# Altium project braking_io.PrjPcb (part 3 of 3)

## Sheet solenoid_drv.SchDoc: Solenoid Control
size A4; Organization: Badgerloop Electrical; Address1: 133 Engineering Research Building; Address2: 1500 Engineering Drive; Address3: Madison, Wi 53706
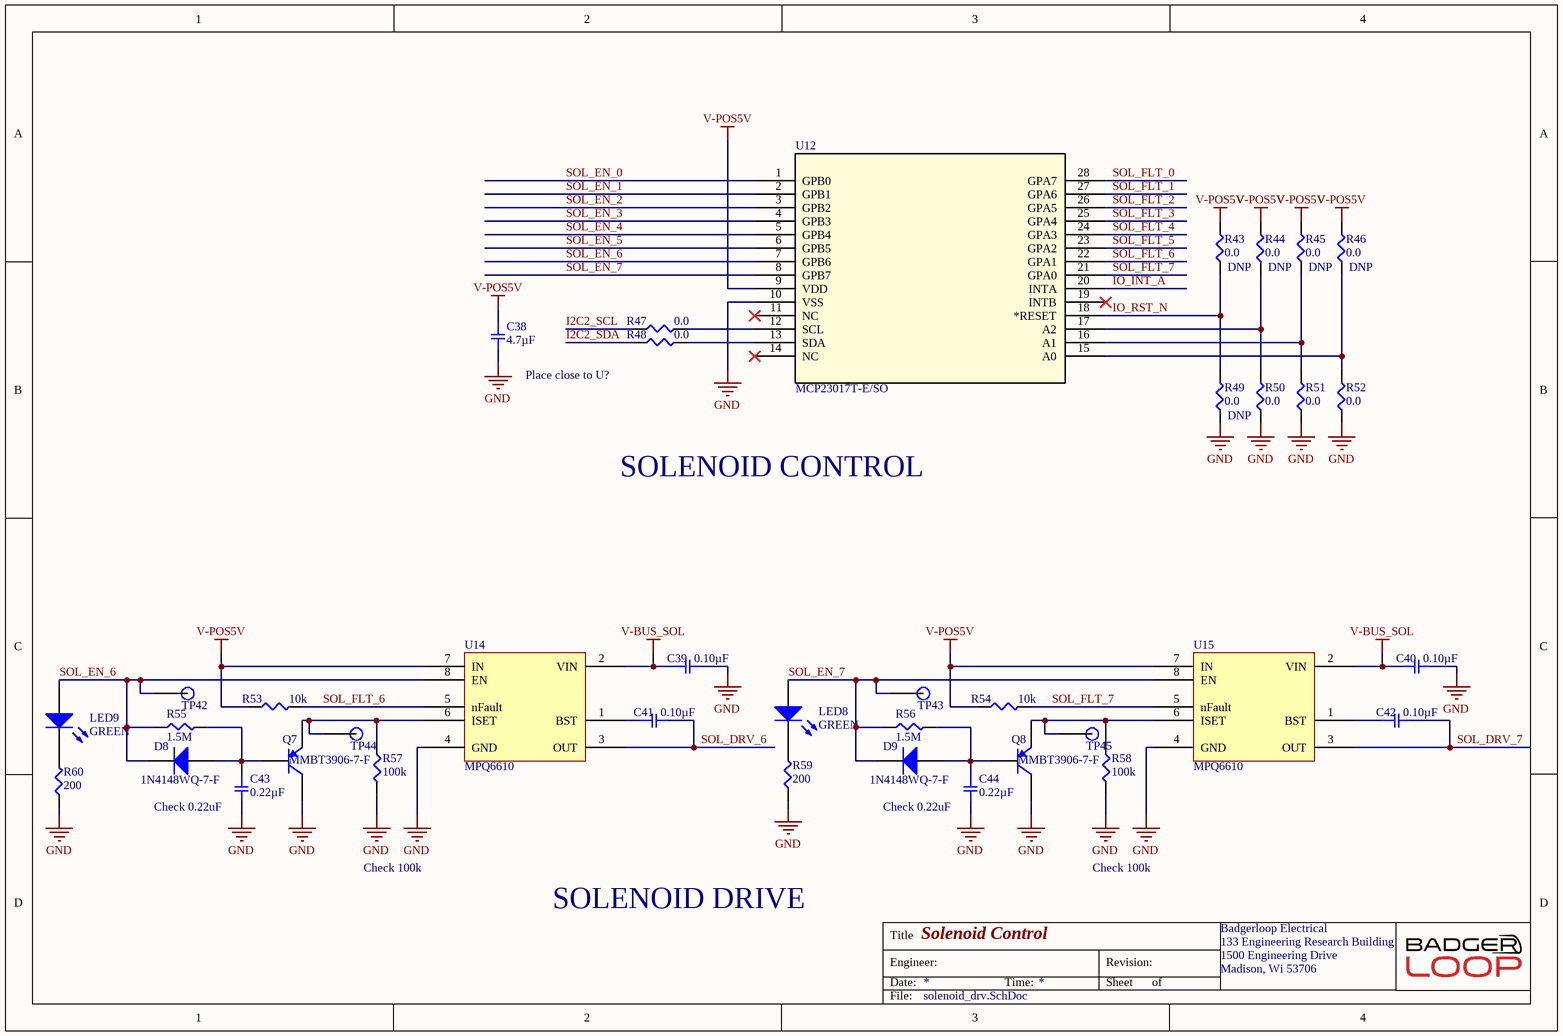
[diagram p6: solenoid_drv.SchDoc]

### Parts
C38  4.7µF  [SMD-0805C]
C39  0.10µF  [SMD-0805C]
C40  0.10µF  [SMD-0805C]
C41  0.10µF  [SMD-0805C]
C42  0.10µF  [SMD-0805C]
C43  0.22µF  [SMD-0805C]
C44  0.22µF  [SMD-0805C]
D8  1N4148WQ-7-F  [SODFL350X80-2N]
D9  1N4148WQ-7-F  [SODFL350X80-2N]
LED8  GREEN  [LED 0603 GREEN]
LED9  GREEN  [LED 0603 GREEN]
Q7  MMBT3906-7-F  [SOTFL103P240X110-3N]
Q8  MMBT3906-7-F  [SOTFL103P240X110-3N]
R43  0.0  [SMD-0805-RES]
R44  0.0  [SMD-0805-RES]
R45  0.0  [SMD-0805-RES]
R46  0.0  [SMD-0805-RES]
R47  0.0  [SMD-0805-RES]
R48  0.0  [SMD-0805-RES]
R49  0.0  [SMD-0805-RES]
R50  0.0  [SMD-0805-RES]
R51  0.0  [SMD-0805-RES]
R52  0.0  [SMD-0805-RES]
R53  10k  [SMD-0805-RES]
R54  10k  [SMD-0805-RES]
R55  1.5M  [SMD-0805-RES]
R56  1.5M  [SMD-0805-RES]
R57  100k  [SMD-0805-RES]
R58  100k  [SMD-0805-RES]
R59  200  [SMD-0805-RES]
R60  200  [SMD-0805-RES]
TP42  TP  [Test Point]  (value not drawn)
TP43  TP  [Test Point]  (value not drawn)
TP44  TP  [Test Point]  (value not drawn)
TP45  TP  [Test Point]  (value not drawn)
U12  MCP23017T-E/SO  [SOIC28-W_MC-M]
U14  MPQ6610  [SOP127P600X175-8N]
U15  MPQ6610  [SOP127P600X175-8N]

### Nets
GND: C38.2 C39.2 C40.2 C43.2 C44.2 Q7.3(C) Q8.3(C) R49.1 R50.1 R51.1 R52.1 R57.2 R58.2 R59.1 R60.1 U12.10(VSS) U14.4(GND) U15.4(GND)
V-BUS_SOL: C39.1 C40.1 U14.2(VIN) U15.2(VIN)
V-POS5V: C38.1 R43.2 R44.2 R45.2 R46.2 R53.1 R54.1 U12.9(VDD) U14.7(IN) U15.7(IN)
I2C2_SCL: R47.1
I2C2_SDA: R48.1
IO_INT_A: U12.20(INTA)
IO_RST_N: R43.1 R49.2 U12.18(*RESET)
SOL_DRV_6: C41.2 U14.3(OUT)
SOL_DRV_7: C42.2 U15.3(OUT)
SOL_EN_0: U12.1(GPB0)
SOL_EN_1: U12.2(GPB1)
SOL_EN_2: U12.3(GPB2)
SOL_EN_3: U12.4(GPB3)
SOL_EN_4: U12.5(GPB4)
SOL_EN_5: U12.6(GPB5)
SOL_EN_6: D8.2(K) LED9.1(A) R55.1 TP42.1 U12.7(GPB6) U14.8(EN)
SOL_EN_7: D9.2(K) LED8.1(A) R56.1 TP43.1 U12.8(GPB7) U15.8(EN)
SOL_FLT_0: U12.28(GPA7)
SOL_FLT_1: U12.27(GPA6)
SOL_FLT_2: U12.26(GPA5)
SOL_FLT_3: U12.25(GPA4)
SOL_FLT_4: U12.24(GPA3)
SOL_FLT_5: U12.23(GPA2)
SOL_FLT_6: R53.2 U12.22(GPA1) U14.5(nFault)
SOL_FLT_7: R54.2 U12.21(GPA0) U15.5(nFault)
NetC41_1: C41.1 U14.1(BST)
NetC42_1: C42.1 U15.1(BST)
NetC43_1: C43.1 D8.1(A) Q7.1(B) R55.2
NetC44_1: C44.1 D9.1(A) Q8.1(B) R56.2
NetLED8_2: LED8.2(K) R59.2
NetLED9_2: LED9.2(K) R60.2
NetQ7_2: Q7.2(E) R57.1 TP44.1 U14.6(ISET)
NetQ8_2: Q8.2(E) R58.1 TP45.1 U15.6(ISET)
NetR44_1: R44.1 R50.2 U12.17(A2)
NetR45_1: R45.1 R51.2 U12.16(A1)
NetR46_1: R46.1 R52.2 U12.15(A0)
NetR47_2: R47.2 U12.12(SCL)
NetR48_2: R48.2 U12.13(SDA)

Not connected (* = marked no-connect by the designer): U12 11(NC)* 14(NC)* 19(INTB)*

### Notes on the sheet
- Place close to U?
- SOLENOID CONTROL
- (near C43) Check 0.22uF
- (near C44) Check 0.22uF
- Check 100k
- SOLENOID DRIVE
- Title
- Engineer:
- Date:
- Time:
- Revision:
- Sheet
- of
- File:

### Library data of the parts
C38 = GRM21BR60J475KA11L: CAP CER 4.7UF 6.3V X5R 0805; Manufacturer: Murata Electronics North America; Factory Stock: 0; Unit Price (USD): 0.28; Minimum Quantity: 1; Tolerance: ±10%; Datasheets: http://www.murata.com/~/media/webrenewal/support/library/catalog/products/capacitor/mlcc/c02e.pdf; Image: //media.digikey.com/Renders/Murata%20Renders/0805%20(2012%20Metric)%20.85mm.jpg; Digi-Key Part Number: 490-9749-1-ND; Part Number: GRM21BR60J475KA11L; Quantity Available: 2821; @ qty: 0; Packaging: Cut Tape (CT); Series: GRM; Part Status: Active; Value: 4.7µF; Voltage: 6.3V; Temperature Coefficient: X5R; Operating Temperature: -55°C ~ 85°C; Features: -; Ratings: -; Applications: General Purpose; Mounting Type: Surface Mount, MLCC; Package / Case: 0805 (2012 Metric); Size / Dimension: 0.079" L x 0.049" W (2.00mm x 1.25mm); Height - Seated (Max): -; Thickness (Max): 0.055" (1.40mm); Lead Spacing: -; Lead Style: -
C39-C42 = GRM21B7U1A104JA01L: CAP CER 0.1UF 10V U2J 0805; Manufacturer: Murata Electronics North America; Factory Stock: 0; Unit Price (USD): 0.4; Minimum Quantity: 1; Tolerance: ±5%; Datasheets: http://www.murata.com/~/media/webrenewal/support/library/catalog/products/capacitor/mlcc/c02e.pdf; Image: //media.digikey.com/Renders/Murata%20Renders/0805%20(2012%20Metric)%20.85mm.jpg; Digi-Key Part Number: 490-11592-1-ND; Part Number: GRM21B7U1A104JA01L; Quantity Available: 3390; @ qty: 0; Packaging: Cut Tape (CT); Series: GRM; Part Status: Active; Value: 0.10µF; Voltage: 10V; Temperature Coefficient: U2J; Operating Temperature: -55°C ~ 125°C; Features: -; Ratings: -; Applications: General Purpose; Mounting Type: Surface Mount, MLCC; Package / Case: 0805 (2012 Metric); Size / Dimension: 0.079" L x 0.049" W (2.00mm x 1.25mm); Height - Seated (Max): -; Thickness (Max): 0.053" (1.35mm); Lead Spacing: -; Lead Style: -
C43 C44 = LLA215R71A224MA14L: CAP CER 0.22UF 10V X7R 0805; Manufacturer: Murata Electronics North America; Factory Stock: 0; Unit Price (USD): 0.36; Minimum Quantity: 1; Tolerance: ±20%; Datasheets: http://www.murata.com/~/media/webrenewal/support/library/catalog/products/capacitor/mlcc/c02e.pdf; Image: //media.digikey.com/Renders/Murata%20Renders/0805-LLA.jpg; Digi-Key Part Number: 490-4432-1-ND; Part Number: LLA215R71A224MA14L; Quantity Available: 9914; @ qty: 0; Packaging: Cut Tape (CT); Series: LLA; Part Status: Active; Value: 0.22µF; Voltage: 10V; Temperature Coefficient: X7R; Operating Temperature: -55°C ~ 125°C; Features: Low ESL (Multi-Terminal); Ratings: -; Applications: Bypass, Decoupling; Mounting Type: Surface Mount, MLCC; Package / Case: 0805 (2012 Metric); Size / Dimension: 0.079" L x 0.049" W (2.00mm x 1.25mm); Height - Seated (Max): -; Thickness (Max): 0.022" (0.55mm); Lead Spacing: -; Lead Style: -
D8 D9 = 1N4148WQ-7-F: Diodes - General Purpose, Power, Switching SMT Fast Switching Diode; Manufacturer: Diodes Inc.; Digikey Link: https://www.digikey.com/product-detail/en/diodes-incorporated/1N4148WQ-7-F/1N4148WQ-7-FDITR-ND/8136126; Manufacturer P/N: 1N4148WQ-7-F; Digikey P/N: 1N4148WQ-7-FDITR-ND
LED8 LED9 = LED GREEN 0603: Manufacturer: Lite-On Inc.; Manufacturer P/N: LTST-C190KGKT; Digikey P/N: 160-1435-1-ND; Package / Case: 0603; Color: GREEN
Q7 Q8 = MMBT3906-7-F: Manufacturer: Diodes Zetex; Collector Emitter Voltage (VCEO): 40V; Max Power Dissipation: 300mW; Polarity: PNP; Max Collector Current: 200mA; hFE Min: 100; Number of Elements: 1; Frequency: 250MHz; Emitter Base Voltage (VEBO): 6V; Collector Emitter Saturation Voltage: -400mV; Element Configuration: Single; Continuous Collector Current: -200mA; Voltage Rating (DC): -40V; Supplier 1: Digi-Key; Manufacturer Part Number: MMBT3906-7-F; Stock 1: 687580; Pricing 1: 1=0.12000, 10=0.11400, 100=0.06190, 500=0.03806, 1000=0.02596 (USD); RoHS: Yes; Mount: Surface Mount; Case/Package: SOT-23; Number of Pins: 3; Weight: 0.000282oz; Contact Plating: Tin,Matte; Min Operating Temperature: -55°C; Max Operating Temperature: 150°C; Packaging: Tape and Reel; Package Quantity: 3000; Transition Frequency: 250MHz; Collector Emitter Breakdown Voltage: 40V; Max Breakdown Voltage: 40V; Collector Base Voltage (VCBO): 40V; Power Dissipation: 300mW; Max Frequency: 250MHz; Gain Bandwidth Product: 250MHz; Current Rating: -200mA; Length: 3.05mm; Height: 1mm; Width: 1.4mm; Radiation Hardening: No; REACH SVHC: No SVHC; Lead Free: Lead Free; ComponentLink1URL: https://datasheet.ciiva.com/27052/1540746-27052408.pdf?src-supplier=Jameco; ComponentLink1Description: https://datasheet.ciiva.com/27052/1540746-27052408.pdf?src-supplier=Jameco; ComponentLink2URL: https://datasheet.ciiva.com/15139/getdatasheetpartid-255292-15139821.pdf?src-supplier=Verical; ComponentLink2Description: https://datasheet.ciiva.com/15139/getdatasheetpartid-255292-15139821.pdf?src-supplier=Verical
R43-R52 = ERJ-6GEY0R00V: RES SMD 0.0 OHM JUMPER 1/8W 0805; Manufacturer: Panasonic Electronic Components; Factory Stock: 0; Unit Price (USD): 0.00544; @ qty: 1500; Minimum Quantity: 1; Power (Watts): 0.125W, 1/8W; Part Number: ERJ-6GEY0R00V; Datasheets: http://industrial.panasonic.com/www-cgi/jvcr13pz.cgi?E+PZ+3+AOA0001+ERJ6GEY0R00V+7+WW; Image: //media.digikey.com/Renders/Panasonic%20Renders/ERJ-0805%20Pkg.jpg; Digi-Key Part Number: P0.0ACT-ND; Quantity Available: 1597627; Packaging: Cut Tape (CT); Series: ERJ; Part Status: Active; Value: 0.0; Tolerance: Jumper; Composition: Thick Film; Features: Automotive AEC-Q200; Temperature Coefficient: -; Operating Temperature: -55°C ~ 155°C; Package / Case: 0805 (2012 Metric); Supplier Device Package: 0805; Size / Dimension: 0.079" L x 0.049" W (2.00mm x 1.25mm); Height - Seated (Max): 0.028" (0.70mm); Number of Terminations: 2; Failure Rate: -
  R43-R46 R49: DNP: DNP
R53 R54 = ERJ-P06J103V: RES SMD 10K OHM 5% 1/2W 0805; Manufacturer: Panasonic Electronic Components; Factory Stock: 0; Unit Price (USD): 0.01839; @ qty: 1500; Minimum Quantity: 1; Power (Watts): 0.5W, 1/2W; Temperature Coefficient: ±200ppm/°C; Part Number: ERJ-P06J103V; Datasheets: https://industrial.panasonic.com/cdbs/www-data/pdf/RDA0000/AOA0000C243.pdf; Image: //media.digikey.com/Renders/Panasonic%20Renders/ERJ-0805%20Pkg.jpg; Digi-Key Part Number: P10KADCT-ND; Quantity Available: 413576; Packaging: Cut Tape (CT); Series: ERJ; Part Status: Active; Value: 10k; Tolerance: ±5%; Composition: Thick Film; Features: Automotive AEC-Q200, Pulse Withstanding; Operating Temperature: -55°C ~ 155°C; Package / Case: 0805 (2012 Metric); Supplier Device Package: 0805; Size / Dimension: 0.079" L x 0.049" W (2.00mm x 1.25mm); Height - Seated (Max): 0.028" (0.70mm); Number of Terminations: 2; Failure Rate: -
R55 R56 = ERJ-6GEYJ155V: RES SMD 1.5M OHM 5% 1/8W 0805; Manufacturer: Panasonic Electronic Components; Factory Stock: 0; Unit Price (USD): 0.00496; @ qty: 1500; Minimum Quantity: 1; Power (Watts): 0.125W, 1/8W; Temperature Coefficient: -400/ +150ppm/°C; Part Number: ERJ-6GEYJ155V; Datasheets: http://industrial.panasonic.com/www-cgi/jvcr13pz.cgi?E+PZ+3+AOA0001+ERJ6GEYJ155V+7+WW; Image: //media.digikey.com/Renders/Panasonic%20Renders/ERJ-0805%20Pkg.jpg; Digi-Key Part Number: P1.5MACT-ND; Quantity Available: 51728; Packaging: Cut Tape (CT); Series: ERJ; Part Status: Active; Value: 1.5M; Tolerance: ±5%; Composition: Thick Film; Features: Automotive AEC-Q200; Operating Temperature: -55°C ~ 155°C; Package / Case: 0805 (2012 Metric); Supplier Device Package: 0805; Size / Dimension: 0.079" L x 0.049" W (2.00mm x 1.25mm); Height - Seated (Max): 0.028" (0.70mm); Number of Terminations: 2; Failure Rate: -
R57 R58 = ERJ-P06J104V: RES SMD 100K OHM 5% 1/2W 0805; Manufacturer: Panasonic Electronic Components; Factory Stock: 0; Unit Price (USD): 0.01839; @ qty: 1500; Minimum Quantity: 1; Power (Watts): 0.5W, 1/2W; Temperature Coefficient: ±200ppm/°C; Part Number: ERJ-P06J104V; Datasheets: https://industrial.panasonic.com/cdbs/www-data/pdf/RDA0000/AOA0000C243.pdf; Image: //media.digikey.com/Renders/Panasonic%20Renders/ERJ-0805%20Pkg.jpg; Digi-Key Part Number: P100KADCT-ND; Quantity Available: 82264; Packaging: Cut Tape (CT); Series: ERJ; Part Status: Active; Value: 100k; Tolerance: ±5%; Composition: Thick Film; Features: Automotive AEC-Q200, Pulse Withstanding; Operating Temperature: -55°C ~ 155°C; Package / Case: 0805 (2012 Metric); Supplier Device Package: 0805; Size / Dimension: 0.079" L x 0.049" W (2.00mm x 1.25mm); Height - Seated (Max): 0.028" (0.70mm); Number of Terminations: 2; Failure Rate: -
R59 R60 = ERJ-P06F2000V: RES SMD 200 OHM 1% 1/2W 0805; Manufacturer: Panasonic Electronic Components; Factory Stock: 0; Unit Price (USD): 0.02534; @ qty: 1500; Minimum Quantity: 1; Power (Watts): 0.5W, 1/2W; Temperature Coefficient: ±100ppm/°C; Part Number: ERJ-P06F2000V; Datasheets: https://industrial.panasonic.com/cdbs/www-data/pdf/RDA0000/AOA0000C243.pdf; Image: //media.digikey.com/Renders/Panasonic%20Renders/ERJ-0805%20Pkg.jpg; Digi-Key Part Number: P16064CT-ND; Quantity Available: 14258; Packaging: Cut Tape (CT); Series: ERJ; Part Status: Active; Value: 200; Tolerance: ±1%; Composition: Thick Film; Features: Automotive AEC-Q200, Pulse Withstanding; Operating Temperature: -55°C ~ 155°C; Package / Case: 0805 (2012 Metric); Supplier Device Package: 0805; Size / Dimension: 0.079" L x 0.049" W (2.00mm x 1.25mm); Height - Seated (Max): 0.028" (0.70mm); Number of Terminations: 2; Failure Rate: -
TP42-TP45 = TP: SMD TEST POINT
U12 = MCP23017T-E/SO: IC I/O EXPANDER I2C 16B 28SOIC; Manufacturer: Microchip; Manufacturer P/N: MCP23017T-E/SO; Digikey P/N: MCP23017T-E/SOCT-ND; Digikey Link: https://www.digikey.com/product-detail/en/microchip-technology/MCP23017T-E-SO/MCP23017T-E-SOCT-ND/5358289

## Sheet pressure.SchDoc: Pressure Sensors
size A4; Organization: Badgerloop Electrical; Address1: 133 Engineering Research Building; Address2: 1500 Engineering Drive; Address3: Madison, Wi 53706
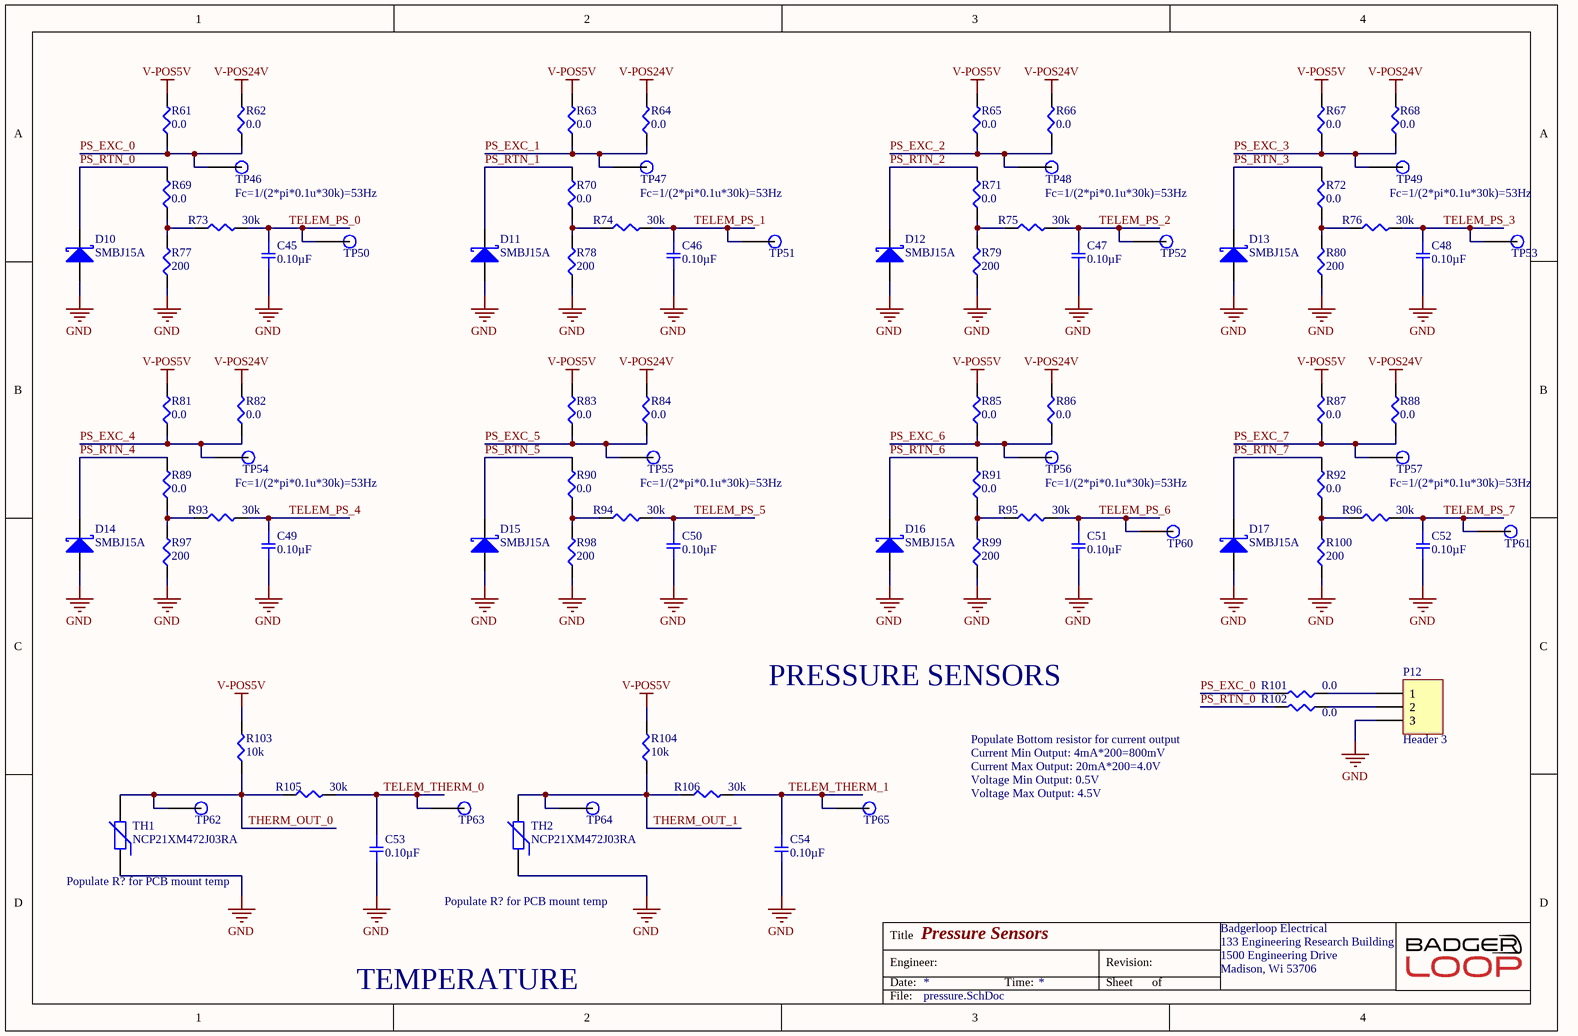
[diagram p7: pressure.SchDoc]

### Parts
C45  0.10µF  [SMD-0805C]
C46  0.10µF  [SMD-0805C]
C47  0.10µF  [SMD-0805C]
C48  0.10µF  [SMD-0805C]
C49  0.10µF  [SMD-0805C]
C50  0.10µF  [SMD-0805C]
C51  0.10µF  [SMD-0805C]
C52  0.10µF  [SMD-0805C]
C53  0.10µF  [SMD-0805C]
C54  0.10µF  [SMD-0805C]
D10  SMBJ15A  [DIOM4436X26N]
D11  SMBJ15A  [DIOM4436X26N]
D12  SMBJ15A  [DIOM4436X26N]
D13  SMBJ15A  [DIOM4436X26N]
D14  SMBJ15A  [DIOM4436X26N]
D15  SMBJ15A  [DIOM4436X26N]
D16  SMBJ15A  [DIOM4436X26N]
D17  SMBJ15A  [DIOM4436X26N]
P12  Header 3  [Pin Header 1x3 TH Pitch 2.54mm]
R61  0.0  [SMD-0805-RES]
R62  0.0  [SMD-0805-RES]
R63  0.0  [SMD-0805-RES]
R64  0.0  [SMD-0805-RES]
R65  0.0  [SMD-0805-RES]
R66  0.0  [SMD-0805-RES]
R67  0.0  [SMD-0805-RES]
R68  0.0  [SMD-0805-RES]
R69  0.0  [SMD-0805-RES]
R70  0.0  [SMD-0805-RES]
R71  0.0  [SMD-0805-RES]
R72  0.0  [SMD-0805-RES]
R73  30k  [SMD-0805-RES]
R74  30k  [SMD-0805-RES]
R75  30k  [SMD-0805-RES]
R76  30k  [SMD-0805-RES]
R77  200  [SMD-0805-RES]
R78  200  [SMD-0805-RES]
R79  200  [SMD-0805-RES]
R80  200  [SMD-0805-RES]
R81  0.0  [SMD-0805-RES]
R82  0.0  [SMD-0805-RES]
R83  0.0  [SMD-0805-RES]
R84  0.0  [SMD-0805-RES]
R85  0.0  [SMD-0805-RES]
R86  0.0  [SMD-0805-RES]
R87  0.0  [SMD-0805-RES]
R88  0.0  [SMD-0805-RES]
R89  0.0  [SMD-0805-RES]
R90  0.0  [SMD-0805-RES]
R91  0.0  [SMD-0805-RES]
R92  0.0  [SMD-0805-RES]
R93  30k  [SMD-0805-RES]
R94  30k  [SMD-0805-RES]
R95  30k  [SMD-0805-RES]
R96  30k  [SMD-0805-RES]
R97  200  [SMD-0805-RES]
R98  200  [SMD-0805-RES]
R99  200  [SMD-0805-RES]
R100  200  [SMD-0805-RES]
R101  0.0  [SMD-0805-RES]
R102  0.0  [SMD-0805-RES]
R103  10k  [SMD-0805-RES]
R104  10k  [SMD-0805-RES]
R105  30k  [SMD-0805-RES]
R106  30k  [SMD-0805-RES]
TH1  NCP21XM472J03RA  [SMD-0805-RES]
TH2  NCP21XM472J03RA  [SMD-0805-RES]
TP46  TP  [Test Point]  (value not drawn)
TP47  TP  [Test Point]  (value not drawn)
TP48  TP  [Test Point]  (value not drawn)
TP49  TP  [Test Point]  (value not drawn)
TP50  TP  [Test Point]  (value not drawn)
TP51  TP  [Test Point]  (value not drawn)
TP52  TP  [Test Point]  (value not drawn)
TP53  TP  [Test Point]  (value not drawn)
TP54  TP  [Test Point]  (value not drawn)
TP55  TP  [Test Point]  (value not drawn)
TP56  TP  [Test Point]  (value not drawn)
TP57  TP  [Test Point]  (value not drawn)
TP60  TP  [Test Point]  (value not drawn)
TP61  TP  [Test Point]  (value not drawn)
TP62  TP  [Test Point]  (value not drawn)
TP63  TP  [Test Point]  (value not drawn)
TP64  TP  [Test Point]  (value not drawn)
TP65  TP  [Test Point]  (value not drawn)

### Nets
GND: C45.2 C46.2 C47.2 C48.2 C49.2 C50.2 C51.2 C52.2 C53.2 C54.2 D10.2(K) D11.2(K) D12.2(K) D13.2(K) D14.2(K) D15.2(K) D16.2(K) D17.2(K) P12.3 R77.1 R78.1 R79.1 R80.1 R97.1 R98.1 R99.1 R100.1 TH1.1 TH2.1
V-POS5V: R61.2 R63.2 R65.2 R67.2 R81.2 R83.2 R85.2 R87.2 R103.2 R104.2
V-POS24V: R62.2 R64.2 R66.2 R68.2 R82.2 R84.2 R86.2 R88.2
PS_EXC_0: R61.1 R62.1 R101.2 TP46.1
PS_EXC_1: R63.1 R64.1 TP47.1
PS_EXC_2: R65.1 R66.1 TP48.1
PS_EXC_3: R67.1 R68.1 TP49.1
PS_EXC_4: R81.1 R82.1 TP54.1
PS_EXC_5: R83.1 R84.1 TP55.1
PS_EXC_6: R85.1 R86.1 TP56.1
PS_EXC_7: R87.1 R88.1 TP57.1
PS_RTN_0: D10.1(A) R69.2 R102.2
PS_RTN_1: D11.1(A) R70.2
PS_RTN_2: D12.1(A) R71.2
PS_RTN_3: D13.1(A) R72.2
PS_RTN_4: D14.1(A) R89.2
PS_RTN_5: D15.1(A) R90.2
PS_RTN_6: D16.1(A) R91.2
PS_RTN_7: D17.1(A) R92.2
TELEM_PS_0: C45.1 R73.2 TP50.1
TELEM_PS_1: C46.1 R74.2 TP51.1
TELEM_PS_2: C47.1 R75.2 TP52.1
TELEM_PS_3: C48.1 R76.2 TP53.1
TELEM_PS_4: C49.1 R93.2
TELEM_PS_5: C50.1 R94.2
TELEM_PS_6: C51.1 R95.2 TP60.1
TELEM_PS_7: C52.1 R96.2 TP61.1
TELEM_THERM_0: C53.1 R105.2 TP63.1
TELEM_THERM_1: C54.1 R106.2 TP65.1
THERM_OUT_0: R103.1 R105.1 TH1.2 TP62.1
THERM_OUT_1: R104.1 R106.1 TH2.2 TP64.1
NetP12_1: P12.1 R101.1
NetP12_2: P12.2 R102.1
NetR69_1: R69.1 R73.1 R77.2
NetR70_1: R70.1 R74.1 R78.2
NetR71_1: R71.1 R75.1 R79.2
NetR72_1: R72.1 R76.1 R80.2
NetR89_1: R89.1 R93.1 R97.2
NetR90_1: R90.1 R94.1 R98.2
NetR91_1: R91.1 R95.1 R99.2
NetR92_1: R92.1 R96.1 R100.2

### Notes on the sheet
- Fc=1/(2*pi*0.1u*30k)=53Hz
- PRESSURE SENSORS
- Populate Bottom resistor for current output
- Current Min Output: 4mA*200=800mV
- Current Max Output: 20mA*200=4.0V
- Voltage Min Output: 0.5V
- Voltage Max Output: 4.5V
- (near TH1) Populate R? for PCB mount temp
- (near TH2) Populate R? for PCB mount temp
- TEMPERATURE
- Title
- Engineer:
- Date:
- Time:
- Revision:
- Sheet
- of
- File:

### Library data of the parts
C45-C52 = GRM219R71E104KA01D: CAP CER 0.1UF 25V X7R 0805; Manufacturer: Murata Electronics North America; Factory Stock: 0; Unit Price (USD): 0.12; Minimum Quantity: 1; Tolerance: ±10%; Datasheets: http://www.murata.com/~/media/webrenewal/support/library/catalog/products/capacitor/mlcc/c02e.pdf; Image: //media.digikey.com/Renders/Murata%20Renders/0805%20(2012%20Metric)%20.85mm.jpg; Digi-Key Part Number: 490-12754-1-ND; Part Number: GRM219R71E104KA01D; Quantity Available: 8594; @ qty: 0; Packaging: Cut Tape (CT); Series: GRM; Part Status: Active; Value: 0.10µF; Voltage: 25V; Temperature Coefficient: X7R; Operating Temperature: -55°C ~ 125°C; Features: -; Ratings: -; Applications: General Purpose; Mounting Type: Surface Mount, MLCC; Package / Case: 0805 (2012 Metric); Size / Dimension: 0.079" L x 0.049" W (2.00mm x 1.25mm); Height - Seated (Max): -; Thickness (Max): 0.037" (0.95mm); Lead Spacing: -; Lead Style: -
C53 C54 = GRM219R71C104KA01D: CAP CER 0.1UF 16V X7R 0805; Manufacturer: Murata Electronics North America; Factory Stock: 0; Unit Price (USD): 0.13; Minimum Quantity: 1; Tolerance: ±10%; Datasheets: http://www.murata.com/~/media/webrenewal/support/library/catalog/products/capacitor/mlcc/c02e.pdf; Image: //media.digikey.com/Renders/Murata%20Renders/0805%20(2012%20Metric)%20.85mm.jpg; Digi-Key Part Number: 490-1683-1-ND; Part Number: GRM219R71C104KA01D; Quantity Available: 265464; @ qty: 0; Packaging: Cut Tape (CT); Series: GRM; Part Status: Active; Value: 0.10µF; Voltage: 16V; Temperature Coefficient: X7R; Operating Temperature: -55°C ~ 125°C; Features: -; Ratings: -; Applications: General Purpose; Mounting Type: Surface Mount, MLCC; Package / Case: 0805 (2012 Metric); Size / Dimension: 0.079" L x 0.049" W (2.00mm x 1.25mm); Height - Seated (Max): -; Thickness (Max): 0.037" (0.95mm); Lead Spacing: -; Lead Style: -
D10-D17 = SMBJ15A: TVS DIODE 15V 24.4V DO214AA; Manufacturer: Littelfuse; Direction: Unidirectional; Min Breakdown Voltage: 16.7V; Peak Pulse Power: 600W; Peak Pulse Current: 24.6A; Test Current: 1mA; Number of Elements: 1; Power Line Protection: No; Max Breakdown Voltage: 18.5V; Max Reverse Leakage Current: 1uA; Max Power Dissipation: 5W; Element Configuration: Single; ESD Protection: Yes; Current: 68A; Voltage: 5V; Supplier 1: Digi-Key; Manufacturer Part Number: SMBJ15A; Stock 1: 73945; Pricing 1: 1=0.45000, 10=0.33900, 25=0.30520, 100=0.21090, 250=0.17760, 500=0.14430, 1000=0.11100 (USD); RoHS: Yes; Mount: Surface Mount; Case/Package: SMB; Number of Pins: 2; Min Operating Temperature: -65°C; Max Operating Temperature: 150°C; Packaging: Tape and Reel; Reverse Standoff Voltage: 15V; Clamping Voltage: 24.4V; Power Dissipation: 600W; Voltage Rating (DC): 15V; Reverse Breakdown Voltage: 16.7V; Package Quantity: 3000; Operating Supply Voltage: 15V; Max Surge Current: 24.6A; Number of Unidirectional Channels: 1; Breakdown Voltage: 16.7V; Number of Channels: 1; Polarity: Unidirectional; Termination: SMD/SMT; Leakage Current: 1uA; Composition: Zener; Length: 4.57mm; Height: 2.237mm; Width: 3.94mm; Radiation Hardening: No; Lead Free: Lead Free; REACH SVHC: Unknown; ComponentLink1URL: https://datasheet.ciiva.com/34301/1078555-34301957.pdf?src-supplier=Jameco; ComponentLink1Description: https://datasheet.ciiva.com/34301/1078555-34301957.pdf?src-supplier=Jameco; ComponentLink2URL: https://datasheet.ciiva.com/25624/0900766b810f4eeb-25624826.pdf?src-supplier=RSComponents; ComponentLink2Description: https://datasheet.ciiva.com/25624/0900766b810f4eeb-25624826.pdf?src-supplier=RSComponents; ComponentLink3URL: https://datasheet.ciiva.com/46385/13057-46385079.pdf?src-supplier=Element14; ComponentLink3Description: https://datasheet.ciiva.com/46385/13057-46385079.pdf?src-supplier=Element14; ComponentLink4URL: https://datasheet.ciiva.com/331/littelfuse-tvs-diode-smbj-datasheet-pdf-331176.pdf?src-supplier=Digi-Key; ComponentLink4Description: https://datasheet.ciiva.com/331/littelfuse-tvs-diode-smbj-datasheet-pdf-331176.pdf?src-supplier=Digi-Key; ComponentLink5URL: https://datasheet.ciiva.com/331/littelfuse-tvs-diode-smbj-datasheet-pdf-331177.pdf?src-supplier=Digi-Key; ComponentLink5Description: https://datasheet.ciiva.com/331/littelfuse-tvs-diode-smbj-datasheet-pdf-331177.pdf?src-supplier=Digi-Key; ComponentLink6URL: https://datasheet.ciiva.com/331/littelfuse-tvs-diode-smbj-datasheet-pdf-331178.pdf?src-supplier=Digi-Key; ComponentLink6Description: https://datasheet.ciiva.com/331/littelfuse-tvs-diode-smbj-datasheet-pdf-331178.pdf?src-supplier=Digi-Key; Supplier 2: Digi-Key; Stock 2: 69911; Pricing 2: 1=0.35000, 10=0.28700, 25=0.26240, 100=0.19540, 250=0.17704, 500=0.14652, 1000=0.10989 (USD); ComponentLink7URL: https://datasheet.ciiva.com/25624/0900766b810f4eeb-25624712.pdf?src-supplier=RSComponents; ComponentLink7Description: https://datasheet.ciiva.com/25624/0900766b810f4eeb-25624712.pdf?src-supplier=RSComponents; ComponentLink8URL: https://datasheet.ciiva.com/34302/1546929-34302459.pdf?src-supplier=Jameco; ComponentLink8Description: https://datasheet.ciiva.com/34302/1546929-34302459.pdf?src-supplier=Jameco; ComponentLink9URL: https://datasheet.ciiva.com/46381/1677318-46381958.pdf?src-supplier=Element14; ComponentLink9Description: https://datasheet.ciiva.com/46381/1677318-46381958.pdf?src-supplier=Element14; ComponentLink10URL: https://datasheet.ciiva.com/331/littelfuse-tvs-diode-smbj-datasheet-pdf-331131.pdf?src-supplier=Digi-Key; ComponentLink10Description: https://datasheet.ciiva.com/331/littelfuse-tvs-diode-smbj-datasheet-pdf-331131.pdf?src-supplier=Digi-Key; ComponentLink11URL: https://datasheet.ciiva.com/331/littelfuse-tvs-diode-smbj-datasheet-pdf-331132.pdf?src-supplier=Digi-Key; ComponentLink11Description: https://datasheet.ciiva.com/331/littelfuse-tvs-diode-smbj-datasheet-pdf-331132.pdf?src-supplier=Digi-Key; ComponentLink12URL: https://datasheet.ciiva.com/331/littelfuse-tvs-diode-smbj-datasheet-pdf-331133.pdf?src-supplier=Digi-Key; ComponentLink12Description: https://datasheet.ciiva.com/331/littelfuse-tvs-diode-smbj-datasheet-pdf-331133.pdf?src-supplier=Digi-Key
P12 = Header 3: Header, 3-Pin; LatestRevisionDate: 17-Jul-2002; LatestRevisionNote: Re-released for DXP Platform.; Publisher: Altium Limited
R61-R72 R81-R92 R101 R102 = ERJ-6GEY0R00V: as R43 on sheet solenoid_drv; Part Number: ERJ-6GEY0R00V; Datasheets: http://industrial.panasonic.com/www-cgi/jvcr13pz.cgi?E+PZ+3+AOA0001+ERJ6GEY0R00V+7+WW; Image: //media.digikey.com/Renders/Panasonic%20Renders/ERJ-0805%20Pkg.jpg; Digi-Key Part Number: P0.0ACT-ND; Quantity Available: 1597627; Packaging: Cut Tape (CT); Series: ERJ; Part Status: Active; Value: 0.0; Tolerance: Jumper; Composition: Thick Film; Features: Automotive AEC-Q200; Temperature Coefficient: -; Operating Temperature: -55°C ~ 155°C; Package / Case: 0805 (2012 Metric); Supplier Device Package: 0805; Size / Dimension: 0.079" L x 0.049" W (2.00mm x 1.25mm); Height - Seated (Max): 0.028" (0.70mm); Number of Terminations: 2; Failure Rate: -
R73-R76 R93-R96 R105 R106 = ERJ-6ENF3002V: RES SMD 30K OHM 1% 1/8W 0805; Manufacturer: Panasonic Electronic Components; Factory Stock: 0; Unit Price (USD): 0.00729; @ qty: 1500; Minimum Quantity: 1; Power (Watts): 0.125W, 1/8W; Temperature Coefficient: ±100ppm/°C; Part Number: ERJ-6ENF3002V; Datasheets: http://industrial.panasonic.com/www-cgi/jvcr13pz.cgi?E+PZ+3+AOA0002+ERJ6ENF3002V+7+WW; Image: //media.digikey.com/Renders/Panasonic%20Renders/ERJ-0805%20Pkg.jpg; Digi-Key Part Number: P30.0KCCT-ND; Quantity Available: 88046; Packaging: Cut Tape (CT); Series: ERJ; Part Status: Active; Value: 30k; Tolerance: ±1%; Composition: Thick Film; Features: Automotive AEC-Q200; Operating Temperature: -55°C ~ 155°C; Package / Case: 0805 (2012 Metric); Supplier Device Package: 0805; Size / Dimension: 0.079" L x 0.049" W (2.00mm x 1.25mm); Height - Seated (Max): 0.028" (0.70mm); Number of Terminations: 2; Failure Rate: -
R77-R80 R97-R100 = ERJ-P06F2000V: as R59 on sheet solenoid_drv; Part Number: ERJ-P06F2000V; Datasheets: https://industrial.panasonic.com/cdbs/www-data/pdf/RDA0000/AOA0000C243.pdf; Image: //media.digikey.com/Renders/Panasonic%20Renders/ERJ-0805%20Pkg.jpg; Digi-Key Part Number: P16064CT-ND; Quantity Available: 14258; Packaging: Cut Tape (CT); Series: ERJ; Part Status: Active; Value: 200; Tolerance: ±1%; Composition: Thick Film; Features: Automotive AEC-Q200, Pulse Withstanding; Operating Temperature: -55°C ~ 155°C; Package / Case: 0805 (2012 Metric); Supplier Device Package: 0805; Size / Dimension: 0.079" L x 0.049" W (2.00mm x 1.25mm); Height - Seated (Max): 0.028" (0.70mm); Number of Terminations: 2; Failure Rate: -
R103 R104 = ERJ-P06F1002V: RES SMD 10K OHM 1% 1/2W 0805; Manufacturer: Panasonic Electronic Components; Factory Stock: 0; Unit Price (USD): 0.02534; @ qty: 1500; Minimum Quantity: 1; Power (Watts): 0.5W, 1/2W; Temperature Coefficient: ±100ppm/°C; Part Number: ERJ-P06F1002V; Datasheets: https://industrial.panasonic.com/cdbs/www-data/pdf/RDA0000/AOA0000C243.pdf; Image: //media.digikey.com/Renders/Panasonic%20Renders/ERJ-0805%20Pkg.jpg; Digi-Key Part Number: P16059CT-ND; Quantity Available: 42054; Packaging: Cut Tape (CT); Series: ERJ; Part Status: Active; Value: 10k; Tolerance: ±1%; Composition: Thick Film; Features: Automotive AEC-Q200, Pulse Withstanding; Operating Temperature: -55°C ~ 155°C; Package / Case: 0805 (2012 Metric); Supplier Device Package: 0805; Size / Dimension: 0.079" L x 0.049" W (2.00mm x 1.25mm); Height - Seated (Max): 0.028" (0.70mm); Number of Terminations: 2; Failure Rate: -
TH1 TH2 = NCP21XM472J03RA: NTC THERMISTOR 4.7K OHM 5% 0805; Manufacturer: Murata; Resistance: 4.7kR; Power Rating: 200mW; Current Rating: 650uA; Accuracy: 3%; Supplier 1: Digi-Key; Manufacturer Part Number: NCP21XM472J03RA; Stock 1: 51855; Pricing 1: 1=0.20000, 5=0.19400, 10=0.17300, 25=0.15920, 50=0.12760, 100=0.10930, 500=0.09564, 1000=0.08197 (USD); RoHS: Yes; Mount: Surface Mount; Case/Package: 0805; Number of Pins: 2; Case Code (Metric): 2012; Case Code (Imperial): 0805; Min Operating Temperature: -40°C; Max Operating Temperature: 125°C; Tolerance: 5%; Packaging: Tape and Reel; Package Quantity: 4000; Max Power Dissipation: 200mW; Termination: SMD/SMT; Length: 2mm; Height: 0.85mm; Depth: 1.25mm; Width: 1.25mm; Radiation Hardening: No; REACH SVHC: No SVHC; Lead Free: Lead Free; ComponentLink1URL: https://datasheet.ciiva.com/30488/0900766b81259d06-30488337.pdf?src-supplier=RSComponents; ComponentLink1Description: https://datasheet.ciiva.com/30488/0900766b81259d06-30488337.pdf?src-supplier=RSComponents; ComponentLink2URL: https://datasheet.ciiva.com/2848/r44e-2848550.pdf?src-supplier=Digi-Key; ComponentLink2Description: https://datasheet.ciiva.com/2848/r44e-2848550.pdf?src-supplier=Digi-Key; ComponentLink3URL: https://datasheet.ciiva.com/24155/r44e-24155222.pdf?src-supplier=Future+Electronics; ComponentLink3Description: https://datasheet.ciiva.com/24155/r44e-24155222.pdf?src-supplier=Future+Electronics; ComponentLink4URL: https://datasheet.ciiva.com/2848/r44e-2848551.pdf?src-supplier=Digi-Key; ComponentLink4Description: https://datasheet.ciiva.com/2848/r44e-2848551.pdf?src-supplier=Digi-Key; ComponentLink5URL: https://datasheet.ciiva.com/2848/r44e-2848552.pdf?src-supplier=Digi-Key; ComponentLink5Description: https://datasheet.ciiva.com/2848/r44e-2848552.pdf?src-supplier=Digi-Key; ComponentLink6URL: https://datasheet.ciiva.com/16634/l0770c-16634105.pdf?src-supplier=Avnet+Europe; ComponentLink6Description: https://datasheet.ciiva.com/16634/l0770c-16634105.pdf?src-supplier=Avnet+Europe; ComponentLink7URL: https://datasheet.ciiva.com/3280/l0770c-3280522.pdf?src-supplier=Avnet; ComponentLink7Description: https://datasheet.ciiva.com/3280/l0770c-3280522.pdf?src-supplier=Avnet; Supplier Part Number 1: 490-2453-1-ND
TP46-TP57 TP60-TP65 = TP: SMD TEST POINT

## Sheet telemetry_adc.SchDoc: ADC
size A4; Organization: Badgerloop Electrical; Address1: 133 Engineering Research Building; Address2: 1500 Engineering Drive; Address3: Madison, Wi 53706
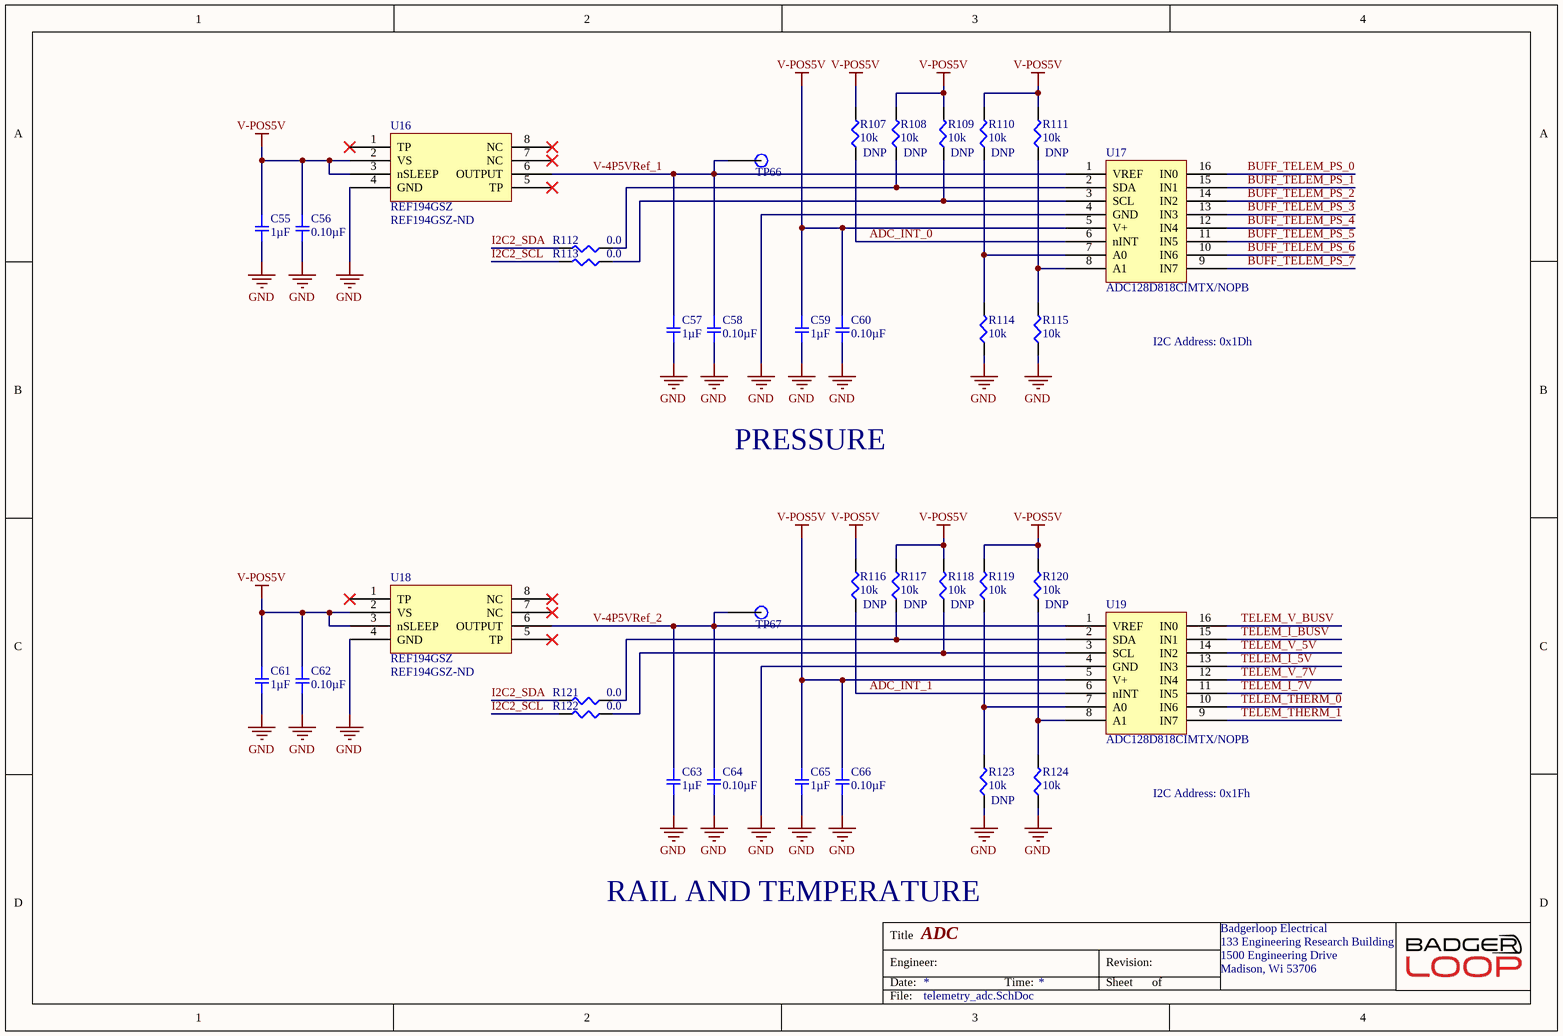
[diagram p8: telemetry_adc.SchDoc]

### Parts
C55  1µF  [SMD-0805C]
C56  0.10µF  [SMD-0805C]
C57  1µF  [SMD-0805C]
C58  0.10µF  [SMD-0805C]
C59  1µF  [SMD-0805C]
C60  0.10µF  [SMD-0805C]
C61  1µF  [SMD-0805C]
C62  0.10µF  [SMD-0805C]
C63  1µF  [SMD-0805C]
C64  0.10µF  [SMD-0805C]
C65  1µF  [SMD-0805C]
C66  0.10µF  [SMD-0805C]
R107  10k  [SMD-0805-RES]
R108  10k  [SMD-0805-RES]
R109  10k  [SMD-0805-RES]
R110  10k  [SMD-0805-RES]
R111  10k  [SMD-0805-RES]
R112  0.0  [SMD-0805-RES]
R113  0.0  [SMD-0805-RES]
R114  10k  [SMD-0805-RES]
R115  10k  [SMD-0805-RES]
R116  10k  [SMD-0805-RES]
R117  10k  [SMD-0805-RES]
R118  10k  [SMD-0805-RES]
R119  10k  [SMD-0805-RES]
R120  10k  [SMD-0805-RES]
R121  0.0  [SMD-0805-RES]
R122  0.0  [SMD-0805-RES]
R123  10k  [SMD-0805-RES]
R124  10k  [SMD-0805-RES]
TP66  TP  [Test Point]  (value not drawn)
TP67  TP  [Test Point]  (value not drawn)
U16  REF194GSZ  Supplier Part Number 1: REF194GSZ-ND  [SOP127P600X175-8N]
U17  ADC128D818CIMTX/NOPB  [TSOP65P660X120-16N]
U18  REF194GSZ  Supplier Part Number 1: REF194GSZ-ND  [SOP127P600X175-8N]
U19  ADC128D818CIMTX/NOPB  [TSOP65P660X120-16N]

### Nets
GND: C55.2 C56.2 C57.2 C58.2 C59.2 C60.2 C61.2 C62.2 C63.2 C64.2 C65.2 C66.2 R114.1 R115.1 R123.1 R124.1 U16.4(GND) U17.4(GND) U18.4(GND) U19.4(GND)
V-POS5V: C55.1 C56.1 C59.1 C60.1 C61.1 C62.1 C65.1 C66.1 R107.2 R108.2 R109.2 R110.2 R111.2 R116.2 R117.2 R118.2 R119.2 R120.2 U16.2(VS) U16.3(nSLEEP) U17.5(V+) U18.2(VS) U18.3(nSLEEP) U19.5(V+)
ADC_INT_0: R107.1 U17.6(nINT)
ADC_INT_1: R116.1 U19.6(nINT)
BUFF_TELEM_PS_0: U17.16(IN0)
BUFF_TELEM_PS_1: U17.15(IN1)
BUFF_TELEM_PS_2: U17.14(IN2)
BUFF_TELEM_PS_3: U17.13(IN3)
BUFF_TELEM_PS_4: U17.12(IN4)
BUFF_TELEM_PS_5: U17.11(IN5)
BUFF_TELEM_PS_6: U17.10(IN6)
BUFF_TELEM_PS_7: U17.9(IN7)
I2C2_SCL: R113.2 R122.2
I2C2_SDA: R112.2 R121.2
TELEM_I_5V: U19.13(IN3)
TELEM_I_7V: U19.11(IN5)
TELEM_I_BUSV: U19.15(IN1)
TELEM_THERM_0: U19.10(IN6)
TELEM_THERM_1: U19.9(IN7)
TELEM_V_5V: U19.14(IN2)
TELEM_V_7V: U19.12(IN4)
TELEM_V_BUSV: U19.16(IN0)
V-4P5VRef_1: C57.1 C58.1 TP66.1 U16.6(OUTPUT) U17.1(VREF)
V-4P5VRef_2: C63.1 C64.1 TP67.1 U18.6(OUTPUT) U19.1(VREF)
NetR108_1: R108.1 R112.1 U17.2(SDA)
NetR109_1: R109.1 R113.1 U17.3(SCL)
NetR110_1: R110.1 R114.2 U17.7(A0)
NetR111_1: R111.1 R115.2 U17.8(A1)
NetR117_1: R117.1 R121.1 U19.2(SDA)
NetR118_1: R118.1 R122.1 U19.3(SCL)
NetR119_1: R119.1 R123.2 U19.7(A0)
NetR120_1: R120.1 R124.2 U19.8(A1)

Not connected (* = marked no-connect by the designer): U16 1(TP)* 5(TP)* 7(NC)* 8(NC)*; U18 1(TP)* 5(TP)* 7(NC)* 8(NC)*

### Notes on the sheet
- I2C Address: 0x1Dh
- PRESSURE
- I2C Address: 0x1Fh
- RAIL AND TEMPERATURE
- Title
- Engineer:
- Date:
- Time:
- Revision:
- Sheet
- of
- File:

### Library data of the parts
C55 C57 C59 C61 C63 C65 = GRM21BR71H105KA12L: CAP CER 1UF 50V X7R 0805; Manufacturer: Murata Electronics North America; Factory Stock: 0; Unit Price (USD): 0.25; Minimum Quantity: 1; Tolerance: ±10%; Datasheets: http://www.murata.com/~/media/webrenewal/support/library/catalog/products/capacitor/mlcc/c02e.pdf; Image: //media.digikey.com/Renders/Murata%20Renders/0805%20(2012%20Metric)%20.85mm.jpg; Digi-Key Part Number: 490-4736-1-ND; Part Number: GRM21BR71H105KA12L; Quantity Available: 988032; @ qty: 0; Packaging: Cut Tape (CT); Series: GRM; Part Status: Active; Value: 1µF; Voltage: 50V; Temperature Coefficient: X7R; Operating Temperature: -55°C ~ 125°C; Features: -; Ratings: -; Applications: General Purpose; Mounting Type: Surface Mount, MLCC; Package / Case: 0805 (2012 Metric); Size / Dimension: 0.079" L x 0.049" W (2.00mm x 1.25mm); Height - Seated (Max): -; Thickness (Max): 0.053" (1.35mm); Lead Spacing: -; Lead Style: -
C56 C58 C60 C62 C64 C66 = GCD21BR71H104KA01L: CAP CER 0.1UF 50V X7R 0805; Manufacturer: Murata Electronics North America; Factory Stock: 0; Unit Price (USD): 0.24; Minimum Quantity: 1; Tolerance: ±10%; Datasheets: http://www.murata.com/~/media/webrenewal/support/library/catalog/products/capacitor/mlcc/c03e.ashx; Image: //media.digikey.com/Renders/Murata%20Renders/0805%28GxM6%29.jpg; Digi-Key Part Number: 490-11955-1-ND; Part Number: GCD21BR71H104KA01L; Quantity Available: 157; @ qty: 0; Packaging: Cut Tape (CT); Series: GCD; Part Status: Active; Value: 0.10µF; Voltage: 50V; Temperature Coefficient: X7R; Operating Temperature: -55°C ~ 125°C; Features: -; Ratings: AEC-Q200; Applications: Automotive; Mounting Type: Surface Mount, MLCC; Package / Case: 0805 (2012 Metric); Size / Dimension: 0.079" L x 0.049" W (2.00mm x 1.25mm); Height - Seated (Max): -; Thickness (Max): 0.049" (1.25mm); Lead Spacing: -; Lead Style: -
R107-R111 R114-R120 R123 R124 = ERJ-P06J103V: as R53 on sheet solenoid_drv; Part Number: ERJ-P06J103V; Datasheets: https://industrial.panasonic.com/cdbs/www-data/pdf/RDA0000/AOA0000C243.pdf; Image: //media.digikey.com/Renders/Panasonic%20Renders/ERJ-0805%20Pkg.jpg; Digi-Key Part Number: P10KADCT-ND; Quantity Available: 413576; Packaging: Cut Tape (CT); Series: ERJ; Part Status: Active; Value: 10k; Tolerance: ±5%; Composition: Thick Film; Features: Automotive AEC-Q200, Pulse Withstanding; Operating Temperature: -55°C ~ 155°C; Package / Case: 0805 (2012 Metric); Supplier Device Package: 0805; Size / Dimension: 0.079" L x 0.049" W (2.00mm x 1.25mm); Height - Seated (Max): 0.028" (0.70mm); Number of Terminations: 2; Failure Rate: -
  R107-R111 R116-R118 R120 R123: DNP: DNP
R112 R113 R121 R122 = ERJ-6GEY0R00V: as R43 on sheet solenoid_drv; Part Number: ERJ-6GEY0R00V; Datasheets: http://industrial.panasonic.com/www-cgi/jvcr13pz.cgi?E+PZ+3+AOA0001+ERJ6GEY0R00V+7+WW; Image: //media.digikey.com/Renders/Panasonic%20Renders/ERJ-0805%20Pkg.jpg; Digi-Key Part Number: P0.0ACT-ND; Quantity Available: 1597627; Packaging: Cut Tape (CT); Series: ERJ; Part Status: Active; Value: 0.0; Tolerance: Jumper; Composition: Thick Film; Features: Automotive AEC-Q200; Temperature Coefficient: -; Operating Temperature: -55°C ~ 155°C; Package / Case: 0805 (2012 Metric); Supplier Device Package: 0805; Size / Dimension: 0.079" L x 0.049" W (2.00mm x 1.25mm); Height - Seated (Max): 0.028" (0.70mm); Number of Terminations: 2; Failure Rate: -
TP66 TP67 = TP: SMD TEST POINT
U16 U18 = REF194GSZ: IC VREF SERIES 4.5V 8SOIC; Manufacturer: Analog Devices; Max Input Voltage: 18V; Max Output Current: 30mA; Temperature Coefficient: 25ppm/°C; Number of Channels: 1; Min Output Voltage: 4.49V; Operating Supply Current: 45uA; Quiescent Current: 15uA; Min Input Voltage: 4.75V; Supplier 1: Digi-Key; Manufacturer Part Number: REF194GSZ; Stock 1: 359; Pricing 1: 1=3.56000, 10=3.19700, 25=3.02240, 100=2.61940, 250=2.48512, 500=2.22988, 1000=1.88062, 2500=1.78659 (USD); RoHS: Yes; Case/Package: R; Number of Pins: 8; Min Operating Temperature: -40°C; Max Operating Temperature: 85°C; Output Voltage: 4.5V; Packaging: Rail/Tube; Output Current: 30mA; Max Output Voltage: 4.5V; Reference Type: Series; Package Quantity: 98; Nominal Supply Current: 45uA; Reference Voltage: 4.5V; Length: 5mm; Height: 1.5mm; Width: 4mm; Radiation Hardening: No; Lead Free: Contains Lead; REACH SVHC: No SVHC; ComponentLink1URL: https://datasheet.ciiva.com/17219/ref19xseries-17219157.pdf?src-supplier=Avnet+Europe; ComponentLink1Description: https://datasheet.ciiva.com/17219/ref19xseries-17219157.pdf?src-supplier=Avnet+Europe; ComponentLink2URL: https://datasheet.ciiva.com/22666/1506113-22666153.pdf?src-supplier=Element14; ComponentLink2Description: https://datasheet.ciiva.com/22666/1506113-22666153.pdf?src-supplier=Element14; ComponentLink3URL: https://datasheet.ciiva.com/2005/ref19xseries-2005902.pdf?src-supplier=Digi-Key; ComponentLink3Description: https://datasheet.ciiva.com/2005/ref19xseries-2005902.pdf?src-supplier=Digi-Key; ComponentLink4URL: https://datasheet.ciiva.com/3235/ref19xseries-3235518.pdf?src-supplier=Avnet; ComponentLink4Description: https://datasheet.ciiva.com/3235/ref19xseries-3235518.pdf?src-supplier=Avnet
U17 U19 = ADC128D818CIMTX/NOPB: Analog to Digital Converters - ADC; Manufacturer: TI National Semiconductor; Resolution: 12b; Sampling Rate: 10000S/s; Number of A/D Converters: 1; Polarity: Unipolar; Max Supply Voltage: 5.5V; Min Supply Voltage: 3V; Interface: I2C; Number of Channels: 8; Max Power Dissipation: 33mW; Number of Converters: 4; Number of Bits: 12; Integral Nonlinearity (INL): -2LSB; Supply Type: Analog,Digital,Single; Power Consumption: 2mW; Power Dissipation: 2.01mW; Differential Nonlinearity: 1LSB; Supplier 1: Digi-Key; Manufacturer Part Number: ADC128D818CIMTX/NOPB; Stock 1: 21177; Pricing 1: 1=4.68000, 10=4.20700, 100=3.44660, 500=2.93402, 1000=2.47447 (USD); RoHS: Yes; Mount: Surface Mount; Case/Package: TSSOP; Number of Pins: 16; Contact Plating: Tin,Matte; Min Operating Temperature: -40°C; Max Operating Temperature: 125°C; Packaging: Tape and Reel; Package Quantity: 2500; Number of Inputs: 8; Number of Elements: 1; Radiation Hardening: No; Lead Free: Lead Free; ComponentLink1URL: https://datasheet.ciiva.com/14259/adc128d818-14259977.pdf?src-supplier=Avnet; ComponentLink1Description: https://datasheet.ciiva.com/14259/adc128d818-14259977.pdf?src-supplier=Avnet; Supplier Part Number 1: 296-41182-1-ND

## Sheet retro.SchDoc: Retro
size A4; Organization: Badgerloop Electrical; Address1: 133 Engineering Research Building; Address2: 1500 Engineering Drive; Address3: Madison, Wi 53706
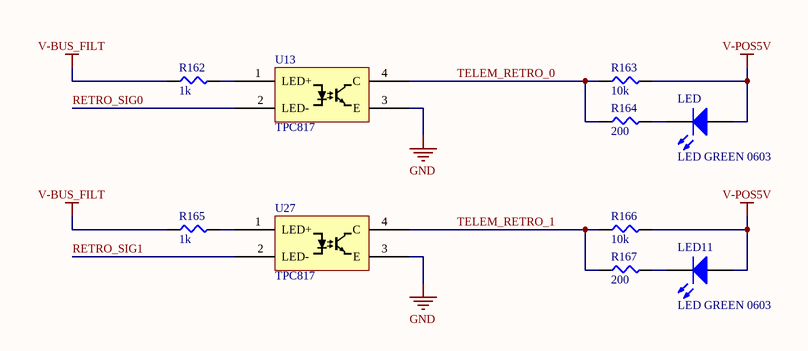
[diagram p9: retro.SchDoc]

### Parts
LED  LED GREEN 0603  [LED 0603 GREEN]
LED11  LED GREEN 0603  [LED 0603 GREEN]
R162  1k  [SMD-0805-RES]
R163  10k  [SMD-0805-RES]
R164  200  [SMD-0805-RES]
R165  1k  [SMD-0805-RES]
R166  10k  [SMD-0805-RES]
R167  200  [SMD-0805-RES]
U13  TPC817  [SOT200P1005X328-5N]
U27  TPC817  [SOT200P1005X328-5N]

### Nets
GND: U13.3(E) U27.3(E)
V-BUS_FILT: R162.1 R165.1
V-POS5V: LED.1(A) LED11.1(A) R163.2 R166.2
RETRO_SIG0: U13.2(LED-)
RETRO_SIG1: U27.2(LED-)
TELEM_RETRO_0: R163.1 R164.1 U13.4(C)
TELEM_RETRO_1: R166.1 R167.1 U27.4(C)
NetLED11_2: LED11.2(K) R167.2
NetLED_2: LED.2(K) R164.2
NetR162_2: R162.2 U13.1(LED+)
NetR165_2: R165.2 U27.1(LED+)

### Notes on the sheet
- Title
- Engineer:
- Date:
- Time:
- Revision:
- Sheet
- of
- File:

### Library data of the parts
LED LED11 = LED GREEN 0603: as LED8 on sheet solenoid_drv; Digikey P/N: 160-1435-1-ND; Package / Case: 0603; Color: GREEN
R162 R165 = ERJ-P06J102V: RES SMD 1K OHM 5% 1/2W 0805; Manufacturer: Panasonic Electronic Components; Factory Stock: 0; Unit Price (USD): 0.01839; @ qty: 1500; Minimum Quantity: 1; Power (Watts): 0.5W, 1/2W; Temperature Coefficient: ±200ppm/°C; Part Number: ERJ-P06J102V; Datasheets: https://industrial.panasonic.com/cdbs/www-data/pdf/RDA0000/AOA0000C243.pdf; Image: //media.digikey.com/Renders/Panasonic%20Renders/ERJ-0805%20Pkg.jpg; Digi-Key Part Number: P1.0KADCT-ND; Quantity Available: 124757; Packaging: Cut Tape (CT); Series: ERJ; Part Status: Active; Value: 1k; Tolerance: ±5%; Composition: Thick Film; Features: Automotive AEC-Q200, Pulse Withstanding; Operating Temperature: -55°C ~ 155°C; Package / Case: 0805 (2012 Metric); Supplier Device Package: 0805; Size / Dimension: 0.079" L x 0.049" W (2.00mm x 1.25mm); Height - Seated (Max): 0.028" (0.70mm); Number of Terminations: 2; Failure Rate: -
R163 R166 = ERJ-P06J103V: as R53 on sheet solenoid_drv; Part Number: ERJ-P06J103V; Datasheets: https://industrial.panasonic.com/cdbs/www-data/pdf/RDA0000/AOA0000C243.pdf; Image: //media.digikey.com/Renders/Panasonic%20Renders/ERJ-0805%20Pkg.jpg; Digi-Key Part Number: P10KADCT-ND; Quantity Available: 413576; Packaging: Cut Tape (CT); Series: ERJ; Part Status: Active; Value: 10k; Tolerance: ±5%; Composition: Thick Film; Features: Automotive AEC-Q200, Pulse Withstanding; Operating Temperature: -55°C ~ 155°C; Package / Case: 0805 (2012 Metric); Supplier Device Package: 0805; Size / Dimension: 0.079" L x 0.049" W (2.00mm x 1.25mm); Height - Seated (Max): 0.028" (0.70mm); Number of Terminations: 2; Failure Rate: -
R164 R167 = ERJ-6ENF2000V: RES SMD 200 OHM 1% 1/8W 0805; Manufacturer: Panasonic Electronic Components; Factory Stock: 0; Unit Price (USD): 0.00729; @ qty: 1500; Minimum Quantity: 1; Power (Watts): 0.125W, 1/8W; Temperature Coefficient: ±100ppm/°C; Part Number: ERJ-6ENF2000V; Datasheets: http://industrial.panasonic.com/www-cgi/jvcr13pz.cgi?E+PZ+3+AOA0002+ERJ6ENF2000V+7+WW; Image: //media.digikey.com/Renders/Panasonic%20Renders/ERJ-0805%20Pkg.jpg; Digi-Key Part Number: P200CCT-ND; Quantity Available: 150759; Packaging: Cut Tape (CT); Series: ERJ; Part Status: Active; Value: 200; Tolerance: ±1%; Composition: Thick Film; Features: Automotive AEC-Q200; Operating Temperature: -55°C ~ 155°C; Package / Case: 0805 (2012 Metric); Supplier Device Package: 0805; Size / Dimension: 0.079" L x 0.049" W (2.00mm x 1.25mm); Height - Seated (Max): 0.028" (0.70mm); Number of Terminations: 2; Failure Rate: -
U13 U27 = TPC817: OPTOISO 5KV TRANS 4SOP; Manufacturer: Taiwan Semi; Manufacturer P/N: TPC817S1B RAG; Digikey Link: https://www.digikey.com/product-detail/en/taiwan-semiconductor-corporation/TPC817S1B-RAG/TPC817S1BRAGCT-ND/7359679; Digikey P/N: TPC817S1BRAGCT-ND

## Sheet unity_gain_buffer.SchDoc: Unity Gain Buffer
size A4; Organization: Badgerloop; Address1: 133 Engineering Research; Address2: Building; Address3: Madison, WI 53715
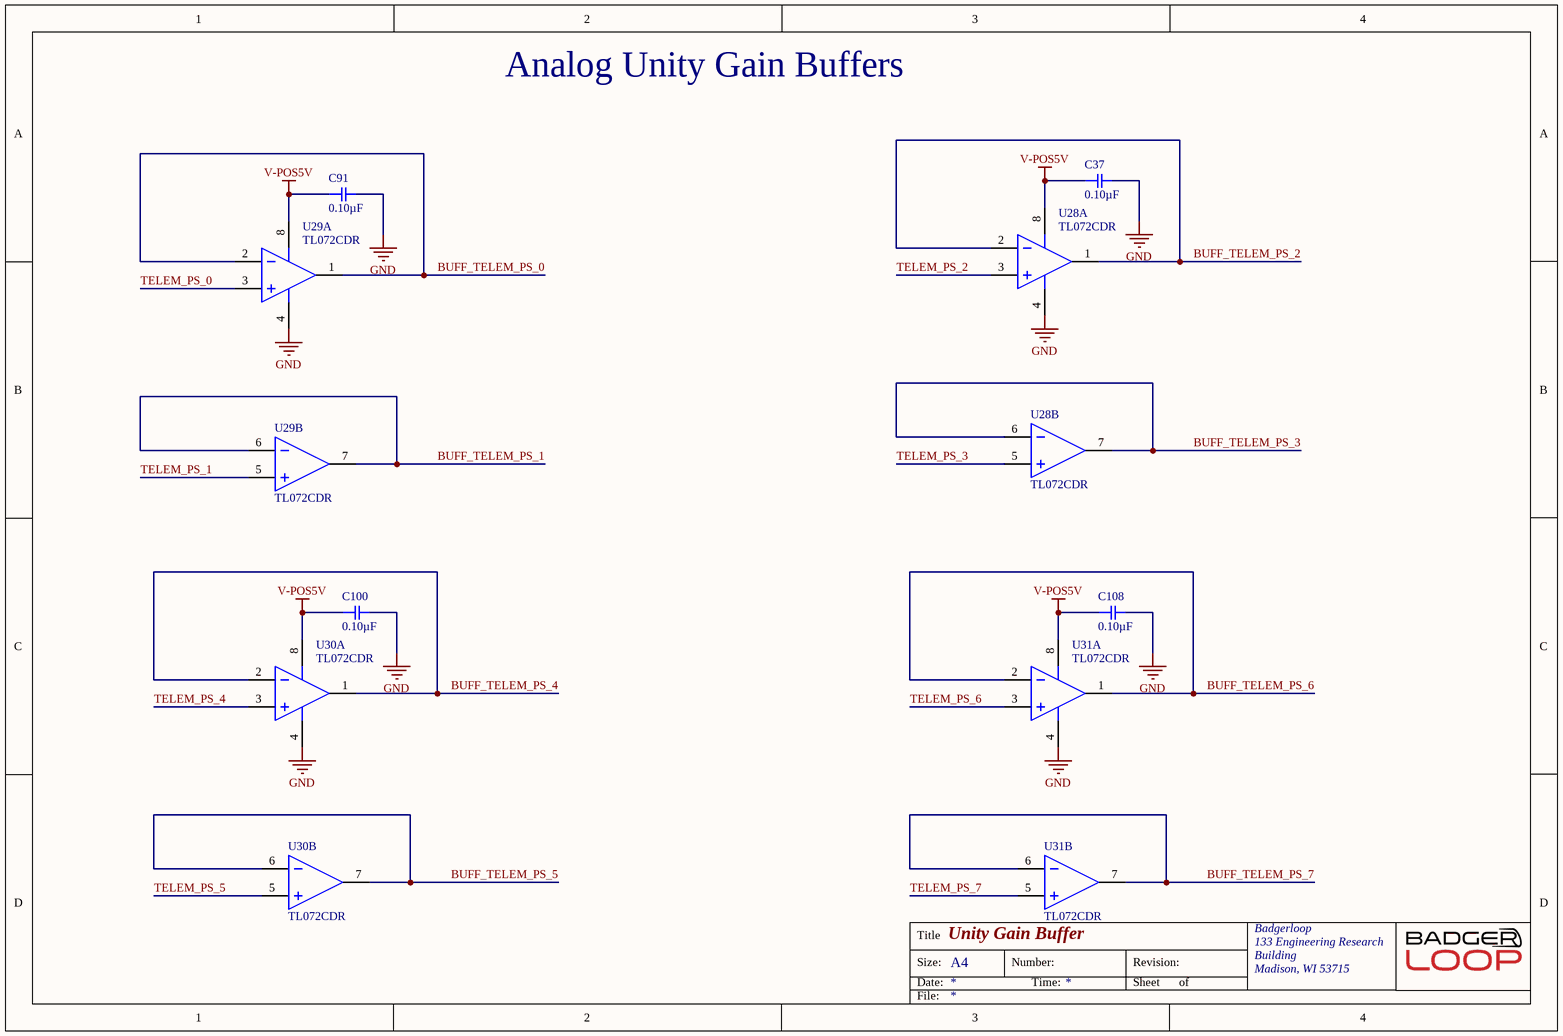
[diagram p10: unity_gain_buffer.SchDoc]

### Parts
C37  0.10µF  [SMD-0805C]
C91  0.10µF  [SMD-0805C]
C100  0.10µF  [SMD-0805C]
C108  0.10µF  [SMD-0805C]
U28  TL072CDR  [SOP127P600X175-8N]  (parts A,B of 2)
U29  TL072CDR  [SOP127P600X175-8N]  (parts A,B of 2)
U30  TL072CDR  [SOP127P600X175-8N]  (parts A,B of 2)
U31  TL072CDR  [SOP127P600X175-8N]  (parts A,B of 2)

### Nets
GND: C37.2 C91.2 C100.2 C108.2 U28.4(V-) U29.4(V-) U30.4(V-) U31.4(V-)
V-POS5V: C37.1 C91.1 C100.1 C108.1 U28.8(V+) U29.8(V+) U30.8(V+) U31.8(V+)
BUFF_TELEM_PS_0: U29.1(OUT) U29.2(IN-)
BUFF_TELEM_PS_1: U29.6(IN-) U29.7(OUT)
BUFF_TELEM_PS_2: U28.1(OUT) U28.2(IN-)
BUFF_TELEM_PS_3: U28.6(IN-) U28.7(OUT)
BUFF_TELEM_PS_4: U30.1(OUT) U30.2(IN-)
BUFF_TELEM_PS_5: U30.6(IN-) U30.7(OUT)
BUFF_TELEM_PS_6: U31.1(OUT) U31.2(IN-)
BUFF_TELEM_PS_7: U31.6(IN-) U31.7(OUT)
TELEM_PS_0: U29.3(IN+)
TELEM_PS_1: U29.5(IN+)
TELEM_PS_2: U28.3(IN+)
TELEM_PS_3: U28.5(IN+)
TELEM_PS_4: U30.3(IN+)
TELEM_PS_5: U30.5(IN+)
TELEM_PS_6: U31.3(IN+)
TELEM_PS_7: U31.5(IN+)

### Notes on the sheet
- Analog Unity Gain Buffers
- Title
- Size:
- Date:
- A4
- Number:
- Time:
- Revision:
- Sheet
- of
- File:

### Library data of the parts
C37 C91 C100 C108 = GRM21B7U1A104JA01L: as C39 on sheet solenoid_drv; Datasheets: http://www.murata.com/~/media/webrenewal/support/library/catalog/products/capacitor/mlcc/c02e.pdf; Image: //media.digikey.com/Renders/Murata%20Renders/0805%20(2012%20Metric)%20.85mm.jpg; Digi-Key Part Number: 490-11592-1-ND; Part Number: GRM21B7U1A104JA01L; Quantity Available: 3390; @ qty: 0; Packaging: Cut Tape (CT); Series: GRM; Part Status: Active; Value: 0.10µF; Voltage: 10V; Temperature Coefficient: U2J; Operating Temperature: -55°C ~ 125°C; Features: -; Ratings: -; Applications: General Purpose; Mounting Type: Surface Mount, MLCC; Package / Case: 0805 (2012 Metric); Size / Dimension: 0.079" L x 0.049" W (2.00mm x 1.25mm); Height - Seated (Max): -; Thickness (Max): 0.053" (1.35mm); Lead Spacing: -; Lead Style: -
U28-U31 = TL072CDR: IC OPAMP JFET 3MHZ 8SOIC; Manufacturer: Texas Instruments; Voltage Gain: 106.02dB; Min Dual Supply Voltage: 3.5V; Max Dual Supply Voltage: 18V; Nominal Supply Current: 5mA; Common Mode Rejection Ratio: 70dB; Number of Channels: 2; Slew Rate: 13V/µs; Max I/O Voltage: 10mV; Input Bias Current: 200pA; Operating Supply Current: 1.4mA; Dual Supply Voltage: 9V; Supplier 1: Digi-Key; Stock 1: 21821; Pricing 1: 1=0.41, 10=0.334, 100=0.2059, 500=0.1562, 1000=0.11715 (USD); Case/Package: D; Number of Pins: 8; Contact Plating: Gold; Min Operating Temperature: -40°C; Max Operating Temperature: 85°C; Package Quantity: 1; Packaging: Tape and Reel; Unity Gain Bandwidth Product: 3MHz; Bandwidth: 3MHz; Nominal Gain Bandwidth Product: 3MHz; Number of Circuits: 2; Gain Bandwidth Product: 3MHz; Input Offset Voltage (Vos): 10mV; Number of Elements: 2; Max Supply Voltage: 18V; Number of Amplifiers: 2; Length: 4.9mm; Height: 1.58mm; Width: 3.91mm; Radiation Hardening: No; Lead Free: Lead Free; REACH SVHC: No SVHC; ComponentLink1URL: http://www.ti.com/lit/ds/symlink/tl071a.pdf?src-supplier=Digi-Key; ComponentLink1Description: http://www.ti.com/lit/ds/symlink/tl071a.pdf?src-supplier=Digi-Key; ComponentLink2URL: http://www.ti.com/general/docs/lit/getliterature.tsp?genericPartNumber=TL072&&fileType=pdf&src-supplier=Avnet; ComponentLink2Description: http://www.ti.com/general/docs/lit/getliterature.tsp?genericPartNumber=TL072&&fileType=pdf&src-supplier=Avnet; ComponentLink3URL: http://www.farnell.com/datasheets/1882732.pdf?src-supplier=Element14; ComponentLink3Description: http://www.farnell.com/datasheets/1882732.pdf?src-supplier=Element14; Supplier Part Number 1: 296-1282-6-ND

## Nets that join several sheets
GND: bus_filter (11 pins), power_7V (21 pins), power_5V (22 pins), power_24V (15 pins), solenoid (37 pins), solenoid_drv (18 pins), pressure (29 pins), telemetry_adc (20 pins), retro (U13.3 U27.3), unity_gain_buffer (8 pins)
V-BUS_FILT: bus_filter (5 pins), power_7V (7 pins), power_5V (6 pins), power_24V (6 pins), retro (R162.1 R165.1)
V-BUS_SOL: bus_filter (F2.2 TP12.1), solenoid (12 pins), solenoid_drv (C39.1 C40.1 U14.2 U15.2)
V-POS5V: bus_filter (5 pins), power_7V (C93.2 U25.3 U25.6), power_5V (10 pins), solenoid (12 pins), solenoid_drv (10 pins), pressure (10 pins), telemetry_adc (24 pins), retro (LED.1 LED11.1 R163.2 R166.2), unity_gain_buffer (8 pins)
V-POS24V: power_24V (5 pins), pressure (8 pins)
BUFF_TELEM_PS_0: telemetry_adc (U17.16), unity_gain_buffer (U29.1 U29.2)
BUFF_TELEM_PS_1: telemetry_adc (U17.15), unity_gain_buffer (U29.6 U29.7)
BUFF_TELEM_PS_2: telemetry_adc (U17.14), unity_gain_buffer (U28.1 U28.2)
BUFF_TELEM_PS_3: telemetry_adc (U17.13), unity_gain_buffer (U28.6 U28.7)
BUFF_TELEM_PS_4: telemetry_adc (U17.12), unity_gain_buffer (U30.1 U30.2)
BUFF_TELEM_PS_5: telemetry_adc (U17.11), unity_gain_buffer (U30.6 U30.7)
BUFF_TELEM_PS_6: telemetry_adc (U17.10), unity_gain_buffer (U31.1 U31.2)
BUFF_TELEM_PS_7: telemetry_adc (U17.9), unity_gain_buffer (U31.6 U31.7)
I2C2_SCL: solenoid_drv (R47.1), telemetry_adc (R113.2 R122.2)
I2C2_SDA: solenoid_drv (R48.1), telemetry_adc (R112.2 R121.2)
SOL_EN_0: solenoid (5 pins), solenoid_drv (U12.1)
SOL_EN_1: solenoid (5 pins), solenoid_drv (U12.2)
SOL_EN_2: solenoid (5 pins), solenoid_drv (U12.3)
SOL_EN_3: solenoid (5 pins), solenoid_drv (U12.4)
SOL_EN_4: solenoid (5 pins), solenoid_drv (U12.5)
SOL_EN_5: solenoid (5 pins), solenoid_drv (U12.6)
SOL_FLT_0: solenoid (R19.2 U6.5), solenoid_drv (U12.28)
SOL_FLT_1: solenoid (R27.2 U8.5), solenoid_drv (U12.27)
SOL_FLT_2: solenoid (R35.2 U10.5), solenoid_drv (U12.26)
SOL_FLT_3: solenoid (R20.2 U7.5), solenoid_drv (U12.25)
SOL_FLT_4: solenoid (R28.2 U9.5), solenoid_drv (U12.24)
SOL_FLT_5: solenoid (R36.2 U11.5), solenoid_drv (U12.23)
TELEM_I_5V: power_5V (C15.1 R13.2 TP21.1), telemetry_adc (U19.13)
TELEM_I_7V: power_7V (C92.1 R152.2 TP91.1), telemetry_adc (U19.11)
TELEM_I_BUSV: bus_filter (TP13.1 U1.5), telemetry_adc (U19.15)
TELEM_PS_0: pressure (C45.1 R73.2 TP50.1), unity_gain_buffer (U29.3)
TELEM_PS_1: pressure (C46.1 R74.2 TP51.1), unity_gain_buffer (U29.5)
TELEM_PS_2: pressure (C47.1 R75.2 TP52.1), unity_gain_buffer (U28.3)
TELEM_PS_3: pressure (C48.1 R76.2 TP53.1), unity_gain_buffer (U28.5)
TELEM_PS_4: pressure (C49.1 R93.2), unity_gain_buffer (U30.3)
TELEM_PS_5: pressure (C50.1 R94.2), unity_gain_buffer (U30.5)
TELEM_PS_6: pressure (C51.1 R95.2 TP60.1), unity_gain_buffer (U31.3)
TELEM_PS_7: pressure (C52.1 R96.2 TP61.1), unity_gain_buffer (U31.5)
TELEM_THERM_0: pressure (C53.1 R105.2 TP63.1), telemetry_adc (U19.10)
TELEM_THERM_1: pressure (C54.1 R106.2 TP65.1), telemetry_adc (U19.9)
TELEM_V_5V: power_5V (C18.1 R16.2 TP22.1), telemetry_adc (U19.14)
TELEM_V_7V: power_7V (C94.1 R155.2 TP92.1), telemetry_adc (U19.12)
TELEM_V_BUSV: bus_filter (C3.1 R5.2 TP14.1), telemetry_adc (U19.16)